# EAGLE design PCM1803A_Breakout-v11 (EAGLE 7.2.0)
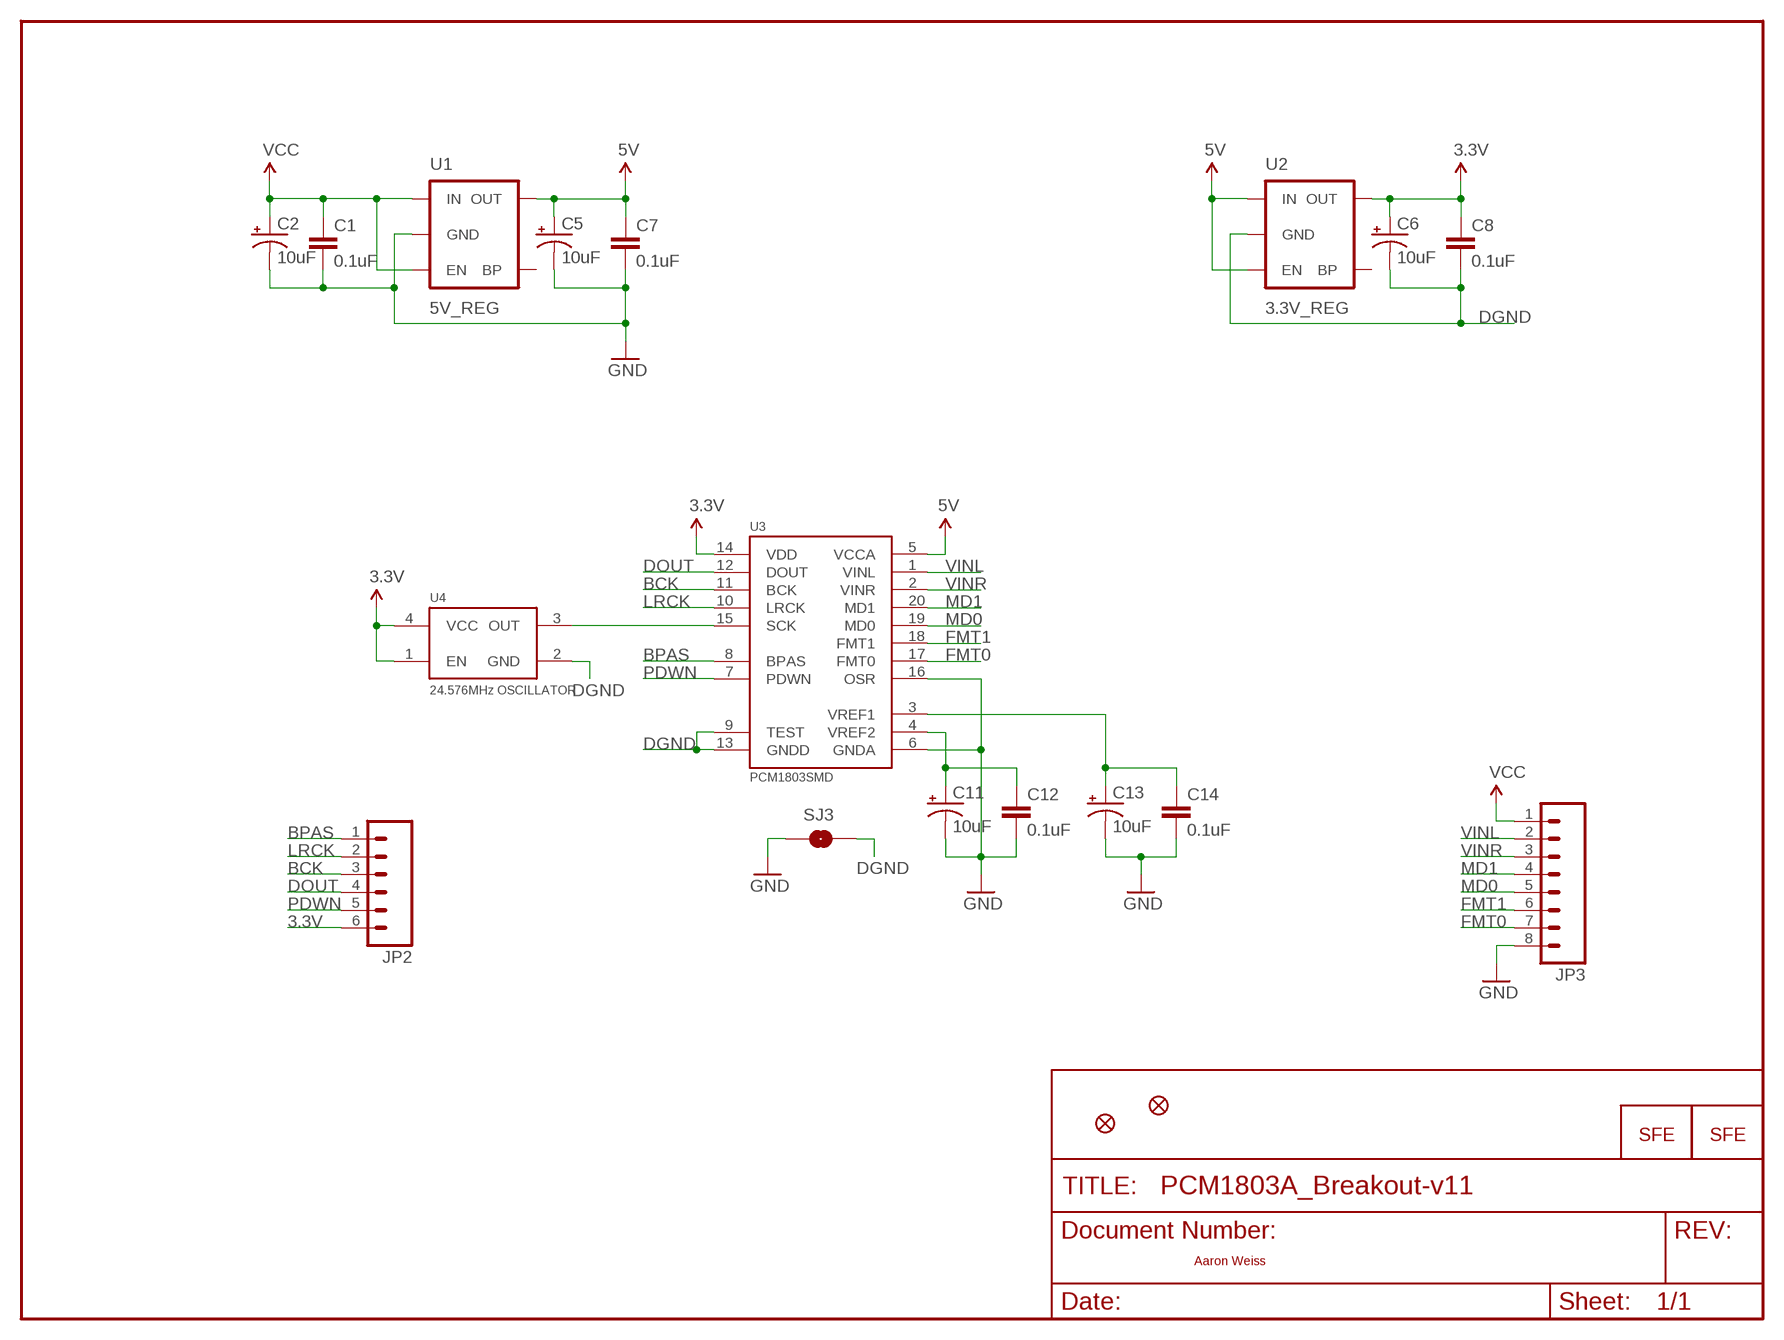
[diagram p0: schematic, sheet 1]

## Parts
C1  0.1uF  CAP0402-CAP  [0402-CAP]
C2  10uF  CAP_POL1206  [EIA3216]
C5  10uF  CAP_POL1206  [EIA3216]
C6  10uF  CAP_POL1206  [EIA3216]
C7  0.1uF  CAP0402-CAP  [0402-CAP]
C8  0.1uF  CAP0402-CAP  [0402-CAP]
C11  10uF  CAP_POL1206  [EIA3216]
C12  0.1uF  CAP0402-CAP  [0402-CAP]
C13  10uF  CAP_POL1206  [EIA3216]
C14  0.1uF  CAP0402-CAP  [0402-CAP]
JP1  LOGO-SFESK  [SFE-LOGO-FLAME]
JP2  M06SIP  [1X06]
JP3  M08  [1X08]
JP4  FIDUCIAL1X2  [FIDUCIAL-1X2]
JP5  FIDUCIAL1X2  [FIDUCIAL-1X2]
SJ3  SOLDERJUMPERTRACE  [SJ_2S-TRACE]
U1  5V_REG  V_REG_LDOSMD  [SOT23-5]
U2  3.3V_REG  V_REG_LDOSMD  [SOT23-5]
U3  PCM1803SMD  [SSOP20]
U4  24.576MHz OSCILLATOR  OSCILLATORSMD6  [CRYSTAL-SMD-7.5X5.2-6PIN]
U$4  LOGO-SFENEW  [SFE-NEW-WEBLOGO]

## Nets
3.3V: C6.A(+) C8.1 JP2.6 U2.5(OUT) U3.14(VDD) U4.1(EN) U4.4(VCC)
5V: C5.A(+) C7.1 U1.5(OUT) U2.1(IN) U2.3(EN) U3.5(VCCA)
BCK: JP2.3 U3.11(BCK)
BPAS: JP2.1 U3.8(BPAS)
DGND: C6.C(-) C8.2 SJ3.2 U2.2(GND) U3.9(TEST) U3.13(GNDD) U4.2(GND)
DOUT: JP2.4 U3.12(DOUT)
FMT0: JP3.7 U3.17(FMT0)
FMT1: JP3.6 U3.18(FMT1)
GND: C1.2 C2.C(-) C5.C(-) C7.2 C11.C(-) C12.2 C13.C(-) C14.2 JP3.8 SJ3.1 U1.2(GND) U3.6(GNDA) U3.16(OSR)
LRCK: JP2.2 U3.10(LRCK)
MD0: JP3.5 U3.19(MD0)
MD1: JP3.4 U3.20(MD1)
N$3: U3.15(SCK) U4.3(OUT)
N$10: C11.A(+) C12.1 U3.4(VREF2)
N$11: C13.A(+) C14.1 U3.3(VREF1)
PDWN: JP2.5 U3.7(PDWN)
VCC: C1.1 C2.A(+) JP3.1 U1.1(IN) U1.3(EN)
VINL: JP3.2 U3.1(VINL)
VINR: JP3.3 U3.2(VINR)
Unconnected: U1.4(BP) U2.4(BP)

## Notes on the sheet
- Aaron Weiss

## Library data of the parts
C1 C7 C8 C12 C14 = SparkFun:CAP: Capacitor Standard 0603 ceramic capacitor, and 0.1" leaded capacitor.
C2 C5 C6 C11 C13 = SparkFun:CAP_POL: Capacitor Polarized These are standard SMD and PTH capacitors. Normally 10uF, 47uF, and 100uF in electrolytic and tantalum varieties. Always verify the external diameter of the through hole cap, it varies with capacity, voltage, and manufacturer. The EIA devices should be standard.
JP1 U$4 = SparkFun:LOGO-SFE: Spark Fun Electronics PCB Logo This is the standard Spark Fun Electronics PCB logo.
JP2 = SparkFun:M06: Header 6 Standard 6-pin 0.1" header. Use with straight break away headers (SKU : PRT-00116), right angle break away headers (PRT-00553), swiss pins (PRT-00743), machine pins (PRT-00117), and female headers (PRT-00115). Molex polarized connector foot print use with SKU : PRT-08094 with associated crimp pins and housings. NOTES ON THE VARIANTS LOCK and LOCK_LONGPADS... This footprint was designed to help hold the alignment of a through-hole component (i.e. 6-pin header) while soldering it into place. You may notice that each hole has been shifted either up or down by 0.005 of an inch from it's more standard position (which is a perfectly straight line). This slight alteration caused the pins (the squares in the middle) to touch the edges of the holes. Because they are alternating, it causes a "brace" to hold the component in place. 0.005 has proven to be the perfect amount of "off-center" position when using our standard breakaway headers. Although looks a little odd when you look at the bare footprint, once you have a header in there, the alteration is very hard to notice. Also, if you push a header all the way into place, it is covered up entirely on the bottom side. This idea of altering the position of holes to aid alignment will be further integrated into the Sparkfun Library for other footprints. It can help hold any component with 3 or more connection pins.
JP3 = SparkFun:M08: Header 8 Standard 8-pin 0.1" header. Use with straight break away headers (SKU : PRT-00116), right angle break away headers (PRT-00553), swiss pins (PRT-00743), machine pins (PRT-00117), and female headers (PRT-00115).
JP4 JP5 = SparkFun:FIDUCIAL: Fiducial Alignment Points Various fiducial points for machine vision alignment.
SJ3 = SparkFun:SOLDERJUMPER: Solder Jumper Standard SMD solder jumper. Used to automate production. Two varients : Normally Open and Normally Closed are the same, but have different paste layers. NC will have a large amount of paste and should jumper during reflow.
U1 U2 = SparkFun:V_REG_LDO: Voltage Regulator LDO Standard 150mA LDO voltage regulator in SOT-23 layout. Micrel part MIC5205. BP (by-pass) pin is used to lower output noise with 470pF cap.
U3 = SparkFun:PCM1803: 24-bit ADC
U4 = SparkFun:OSCILLATOR

## Board
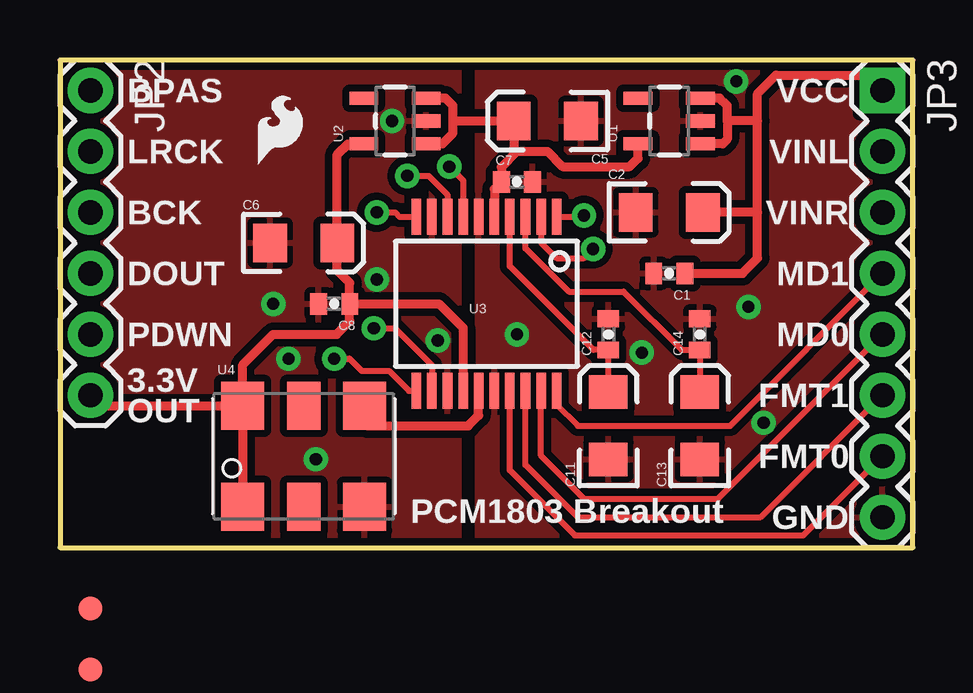
[diagram p1: board, top side]
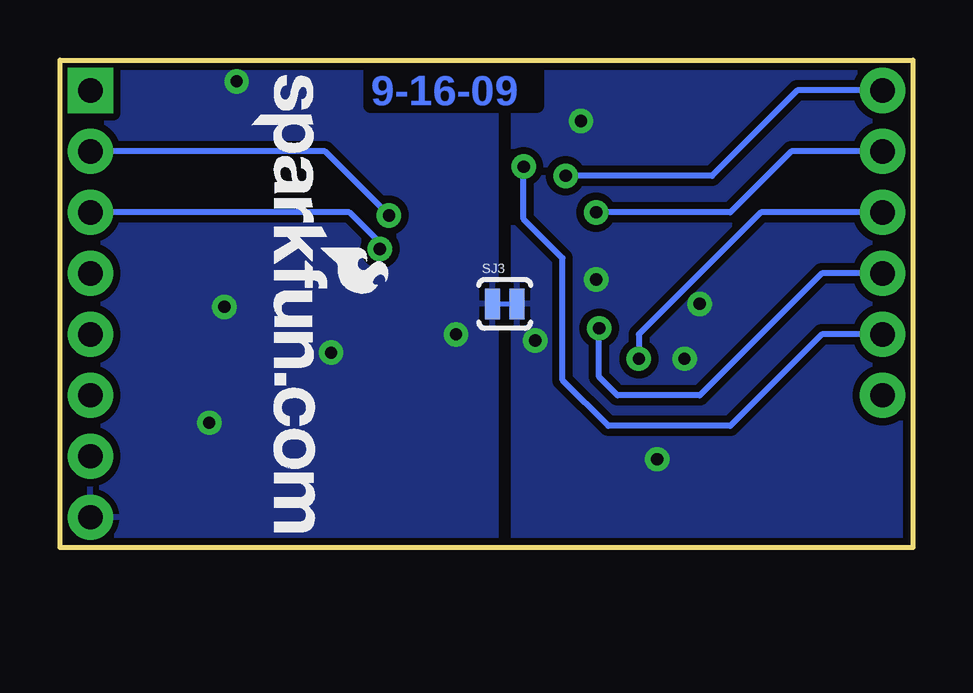
[diagram p2: board, bottom side, seen from below]

Size 35.56 x 20.32 mm. Coordinates in mm from the lower left corner, seen from the top.
Outline: 0,0 35.56,0 35.56,20.32 0,20.32 0,0
Copper layers (1*16): Top 0.035mm / dielectric 1.5mm / Bottom 0.035mm
Design rules "SparkFun": minimum track width 8mil, minimum drill 20mil, track to track 8mil, track to pad 8mil, pad to pad 8mil, via to via 8mil, smd to smd 8mil, copper to edge 9mil, drill to drill 8mil, minimum pad ring 12mil, minimum via ring 10mil, stop-mask expansion 4mil, vias tented up to drill 20mil, thermal gap 10mil

### Footprints (pad centres in the part's own frame; a part is rotated, then mirrored left to right if it is on the bottom)
0402-CAP = smd 0.7 x 0.9: 1 -0.65,0; 2 0.65,0
EIA3216 = smd 1.4 x 1.6: A 1.4,0; C -1.4,0
1X06 = drill 1.016 pad 1.88: 1 0,0; 2 2.54,0; 3 5.08,0; 4 7.62,0; 5 10.16,0; 6 12.7,0
1X08 = drill 1.016 pad 1.88 square: 1 0,0 | drill 1.016 pad 1.88: 2 2.54,0; 3 5.08,0; 4 7.62,0; 5 10.16,0; 6 12.7,0; 7 15.24,0; 8 17.78,0
FIDUCIAL-1X2 = smd 1 x 1: 1 0,0
SJ_2S-TRACE = smd 0.635 x 1.27: 1 -0.508,0; 2 0.508,0
SOT23-5 = smd 0.55 x 1.2: 1 -0.95,-1.3; 2 0,-1.3; 3 0.95,-1.3; 4 0.95,1.3; 5 -0.95,1.3
SSOP20 = smd 0.4 x 1.5: 1 -2.925,-3.625; 2 -2.275,-3.625; 3 -1.625,-3.625; 4 -0.975,-3.625; 5 -0.325,-3.625; 6 0.325,-3.625; 7 0.975,-3.625; 8 1.625,-3.625; 9 2.275,-3.625; 10 2.925,-3.625; 11 2.925,3.625; 12 2.275,3.625; 13 1.625,3.625; 14 0.975,3.625; 15 0.325,3.625; 16 -0.325,3.625; 17 -0.975,3.625; 18 -1.625,3.625; 19 -2.275,3.625; 20 -2.925,3.625
CRYSTAL-SMD-7.5X5.2-6PIN = smd 1.8 x 2: 1 -2.54,-2.1; 2 2.54,-2.1; 3 2.54,2.1; 4 -2.54,2.1 | smd 1.4 x 2: NC0 0,-2.1; NC1 0,2.1

### Placement (x,y rotation side)
C1  25.4,11.43 180 top
C2  25.4,13.97 0 top
C5  20.32,17.78 180 top
C6  10.16,12.7 0 top
C7  19.05,15.24 0 top
C8  11.43,10.16 180 top
C11  22.86,5.08 90 top
C12  22.86,8.89 90 top
C13  26.67,5.08 90 top
C14  26.67,8.89 90 top
JP1  8.26,16 0 top
JP2  1.27,19.05 270 top
JP3  34.29,19.05 270 top
JP4  1.27,-2.54 0 top
JP5  1.27,-5.08 0 top  (outside the outline)
SJ3  17.02,10.16 0 bottom
U1  25.4,17.78 90 top
U2  13.97,17.78 90 top
U3  17.78,10.16 180 top
U4  10.16,3.81 0 top
U$4  27.56,19.68 270 bottom

### Tracks (layer width: path | path; a pad name or v marks a point on that pad's centre or on a via)
3.3V
  Top 0.381: C8.1 15.8,10.16 16.8,9.15 U3.14 | U4.4 7.62,7.62 8.89,8.89 11.53,8.89 12.08,9.44 C8.1 | C8.1 12.08,11.03 11.56,11.55 C6.A 11.56,16.39 12,16.83 U2.5 | U4.4 U4.1 | U4.4 1.71,5.91 JP2.6
5V
  Top 0.381: U1.5 24.1,16.23 23.75,15.88 20.95,15.88 20.32,16.51 19.05,16.51 | U3.5 18.11,14.95 C7.1 18.4,15.86 19.05,16.51 | U2.3 16.07,18.73 16.38,18.41 16.38,17.78 | 16.38,17.78 16.38,17.27 15.94,16.83 U2.1 | 16.38,17.78 C5.A 18.92,16.64 19.05,16.51
BCK  (via drill 0.51)
  Top 0.254: v11.43,7.87 12.06,7.87 12.57,7.37 13.72,7.37 14.55,6.54 U3.11
  Bottom 0.254: v11.43,7.87 11.43,8.89 6.35,13.97 JP2.3
BPAS  (via drill 0.51)
  Top 0.254: U3.8 16.16,14.71 15.37,15.49 v14.48,15.49
  Bottom 0.254: v14.48,15.49 8.38,15.49 4.83,19.05 JP2.1
DGND  (via drill 0.51)
  other vias: 13.84,17.78 10.67,3.68 13.21,11.18 15.75,8.64 8.89,10.16 9.53,7.87
  pour Top (isolate 0.305): 0,20.32 0,0 16.64,0 16.64,20.32
  pour Bottom (isolate 0.305): 0,20.32 0,0 16.64,0 16.64,20.32
DOUT  (via drill 0.51)
  Top 0.254: U3.12 15.51,7.61 13.97,9.14 v13.08,9.14
  Bottom 0.254: v13.08,9.14 13.08,7.11 12.32,6.35 8.89,6.35 3.81,11.43 JP2.4
FMT0
  Top 0.254: U3.17 18.75,3.22 21.46,0.51 30.99,0.51 JP3.7
FMT1
  Top 0.254: U3.18 19.41,3.46 21.59,1.27 29.21,1.27 JP3.6
GND  (via drill 0.51)
  other vias: 28.19,19.43 29.34,5.21 28.7,10.03 24.26,8.13 19.05,8.89
  pour Bottom (isolate 0.305): 17.4,20.32 17.4,0 35.56,0 35.56,20.32
  pour Top (isolate 0.305): 17.4,20.32 17.4,0 35.56,0 35.56,20.32
LRCK  (via drill 0.51)
  Top 0.254: U3.10 14.17,13.79 13.98,13.97 v13.21,13.97
  Bottom 0.254: JP2.2 5.08,16.51 7.62,13.97 v13.21,13.97
MD0
  Top 0.254: U3.19 20.05,3.82 21.84,2.03 27.43,2.03 JP3.5
MD1
  Top 0.254: U3.20 20.7,5.96 21.59,5.08 27.94,5.08 JP3.4
N$3
  Top 0.254: U4.3 12.83,5.78
  Top 0.381: U3.15 17.45,5.52 17.02,5.08 12.83,5.08 12.83,5.78
N$10
  Top 0.254: U3.4 18.75,11.72 22.24,8.24 C12.1 C11.A
N$11
  Top 0.254: U3.3 19.41,12.47 21.21,10.67 23.5,10.67 25.92,8.24 C14.1 C13.A
PDWN  (via drill 0.51)
  Top 0.254: U3.7 16.8,15.3 v16.23,15.88
  Bottom 0.254: v16.23,15.88 16.23,13.69 14.61,12.06 14.61,6.99 12.7,5.08 7.62,5.08 3.81,8.89 JP2.5
VCC
  Top 0.381: U1.3 27.5,18.73 27.81,18.41 27.81,17.78 | U1.1 27.62,16.83 27.81,17.02 27.81,17.78 | 29.08,13.97 29.08,12.06 28.45,11.43 C1.1 | 29.08,13.97 29.08,17.78 | 29.08,17.78 29.08,18.92 29.84,19.68 33.66,19.68 JP3.1 | 29.08,13.97 C2.A | 29.08,17.78 27.81,17.78
VINL  (via drill 0.51)
  Top 0.254: U3.1 21.79,13.79 v21.84,13.84
  Bottom 0.254: v21.84,13.84 24.51,16.51 JP3.2
VINR  (via drill 0.51)
  Top 0.254: U3.2 20.05,12.71 20.7,12.06 21.84,12.06 v22.23,12.45
  Bottom 0.254: JP3.3 23.5,13.97 22.23,12.7 v22.23,12.45

### Text on the board
Bottom: 9-16-09
tPlace: VCC | BPAS | VINL | LRCK | VINR | BCK | MD1 | DOUT | MD0 | PDWN | FMT1 | 3.3V | OUT | FMT0 | GND | PCM1803 Breakout